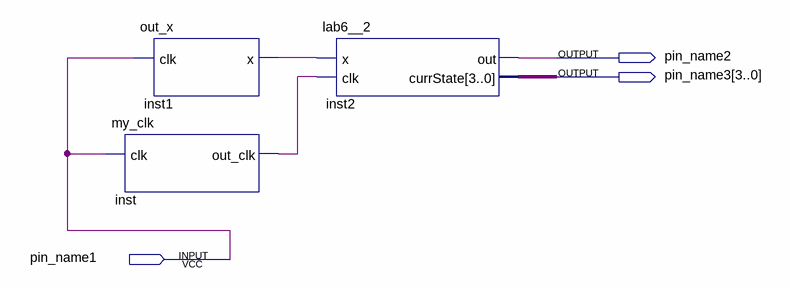
[diagram p0: schematic sheet]
// Quartus schematic lab6_2.bdf as structural Verilog: 3 symbols, 3 pins
module lab6_2 (
  input  pin_name1,
  output pin_name2,
  output [3:0] pin_name3
);

  wire inst1_x, inst_out_clk;

  my_clk inst (.clk(pin_name1), .out_clk(inst_out_clk));
  out_x inst1 (.clk(pin_name1), .x(inst1_x));
  lab6__2 inst2 (.x(inst1_x), .clk(inst_out_clk), .out(pin_name2), .currState(pin_name3));
endmodule
